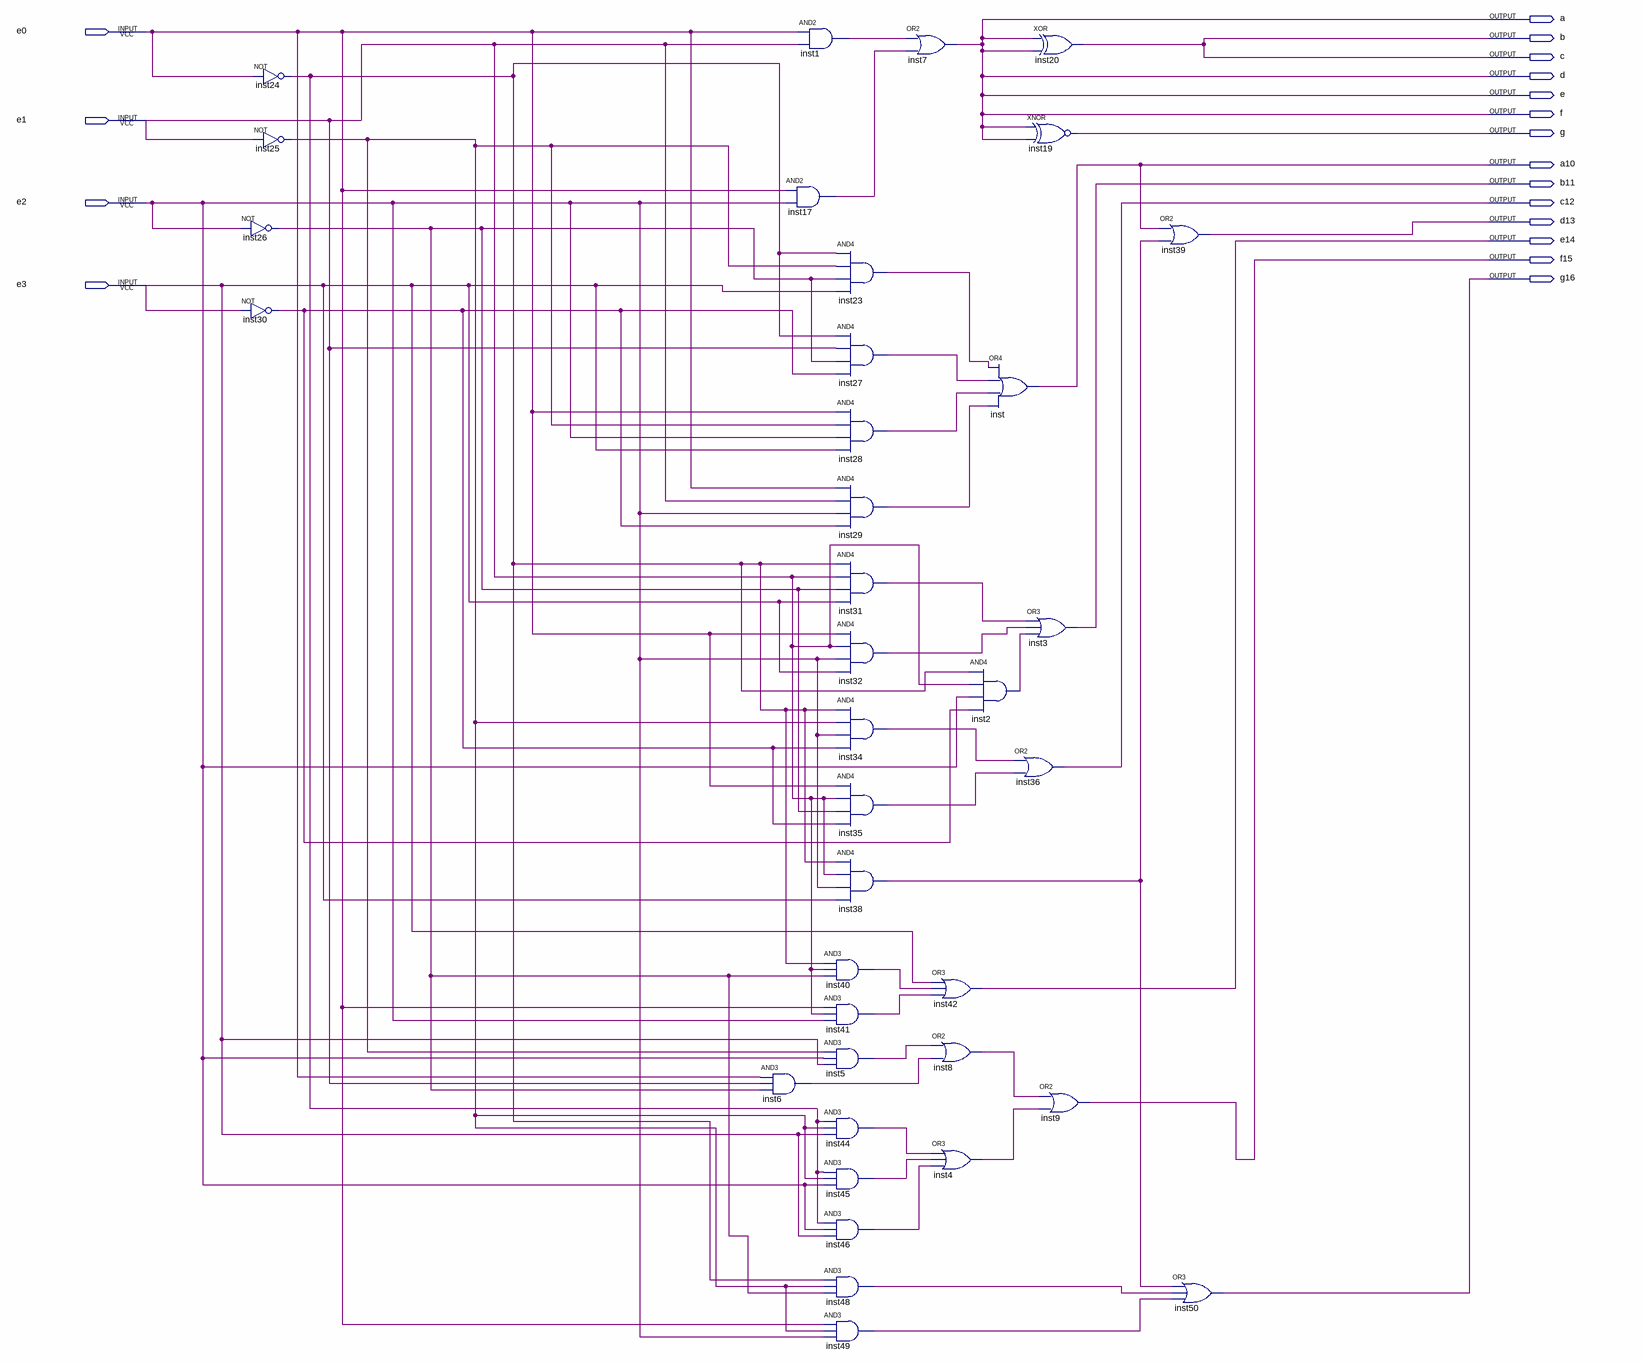
[diagram p0: schematic sheet]
// Quartus schematic sdDecIn6correto.bdf as structural Verilog: 37 symbols, 18 pins
module sdDecIn6correto (
  input  e0,
  input  e1,
  input  e2,
  input  e3,
  output a,
  output b,
  output c,
  output d,
  output e,
  output f,
  output g,
  output a10,
  output b11,
  output c12,
  output d13,
  output e14,
  output f15,
  output g16
);

  wire inst1_out, inst2_out, inst4_out, inst5_out, inst6_out, inst8_out, inst17_out, inst23_out, inst24_out,
       inst25_out, inst26_out, inst27_out, inst28_out, inst29_out, inst30_out, inst31_out, inst32_out,
       inst34_out, inst35_out, inst38_out, inst40_out, inst41_out, inst44_out, inst45_out, inst46_out,
       inst48_out, inst49_out;

  not inst24 (inst24_out, e0);
  not inst25 (inst25_out, e1);
  not inst26 (inst26_out, e2);
  not inst30 (inst30_out, e3);
  and inst6 (inst6_out, e0, e1, inst26_out);
  and inst1 (inst1_out, e0, e1);
  and inst17 (inst17_out, e0, e2);
  and inst23 (inst23_out, inst24_out, inst25_out, inst26_out, e3);
  and inst27 (inst27_out, inst24_out, e1, inst26_out, inst30_out);
  and inst28 (inst28_out, e0, inst25_out, e2, e3);
  and inst29 (inst29_out, e0, e1, e2, inst30_out);
  and inst31 (inst31_out, inst24_out, e1, inst26_out, e3);
  and inst32 (inst32_out, e0, e1, e2, e3);
  and inst34 (inst34_out, inst24_out, inst25_out, e2, inst30_out);
  and inst35 (inst35_out, e0, e1, inst26_out, inst30_out);
  and inst38 (inst38_out, inst24_out, e1, e2, e3);
  and inst40 (inst40_out, inst24_out, e1, inst26_out);
  and inst41 (inst41_out, e0, e1, e2);
  and inst5 (inst5_out, inst25_out, e2, e3);
  and inst44 (inst44_out, inst24_out, inst25_out, e3);
  and inst45 (inst45_out, inst24_out, inst25_out, e2);
  and inst46 (inst46_out, inst24_out, e2, e3);
  and inst48 (inst48_out, inst24_out, inst25_out, inst26_out);
  and inst49 (inst49_out, e0, inst25_out, e2);
  or inst7 (a, inst1_out, inst17_out);
  and inst2 (inst2_out, inst24_out, e1, e2, inst30_out);
  or inst42 (e14, e3, inst40_out, inst41_out);
  or inst8 (inst8_out, inst5_out, inst6_out);
  or inst4 (inst4_out, inst44_out, inst45_out, inst46_out);
  or inst (a10, inst23_out, inst27_out, inst28_out, inst29_out);
  or inst36 (c12, inst34_out, inst35_out);
  xor inst20 (b, a, a);
  xnor inst19 (g, a, a);
  or inst3 (b11, inst31_out, inst32_out, inst2_out);
  or inst9 (f15, inst8_out, inst4_out);
  or inst39 (d13, a10, inst38_out);
  or inst50 (g16, inst38_out, inst48_out, inst49_out);

  assign c = b;
  assign d = a;
  assign e = a;
  assign f = a;
endmodule
